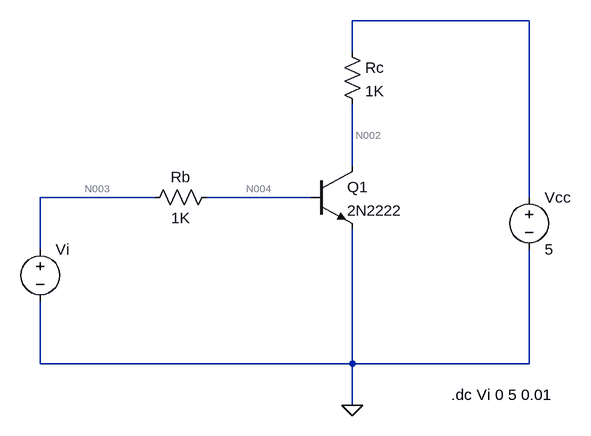
[diagram p0: schematic 12.asc]
12.asc, the LTspice schematic file:
Version 4.1
SHEET 1 880 680
WIRE 544 -96 272 -96
WIRE 272 -48 272 -96
WIRE 272 128 272 32
WIRE -32 176 -208 176
WIRE 208 176 48 176
WIRE 544 176 544 -96
WIRE -208 256 -208 176
WIRE -208 432 -208 336
WIRE 272 432 272 224
WIRE 272 432 -208 432
WIRE 544 432 544 256
WIRE 544 432 272 432
WIRE 272 496 272 432
FLAG 272 496 0
SYMBOL res 64 160 R90
WINDOW 0 0 56 VBottom 2
WINDOW 3 32 56 VTop 2
SYMATTR InstName Rb
SYMATTR Value 1K
SYMBOL voltage -208 240 R0
SYMATTR InstName Vi
SYMATTR Value ""
SYMBOL voltage 544 160 R0
SYMATTR InstName Vcc
SYMATTR Value 5
SYMBOL res 256 -64 R0
SYMATTR InstName Rc
SYMATTR Value 1K
SYMBOL npn 208 128 R0
SYMATTR InstName Q1
SYMATTR Value 2N2222
TEXT 424 480 Left 2 !.dc Vi 0 5 0.01

The netlist it stands for:
* 12.asc
Rb N004 N003 1K
Vi N003 0
Vcc N001 0 5
Rc N001 N002 1K
Q1 N002 N004 0 0 2N2222
.model NPN NPN
.model PNP PNP
.lib standard.bjt
.dc Vi 0 5 0.01
.backanno
.end

* Results of the author's LTspice run, read from the files saved beside the schematic
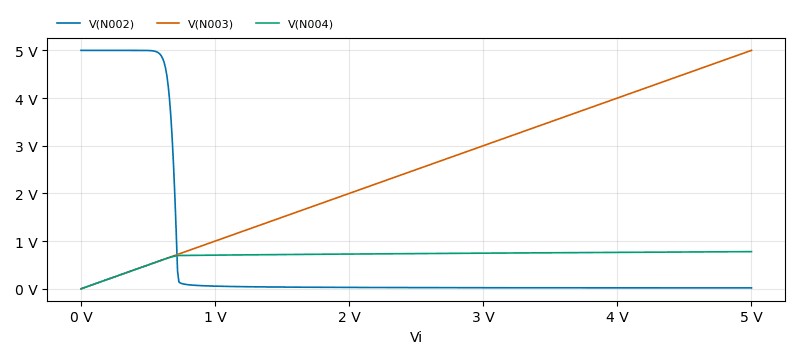
[diagram p1: DC transfer characteristic of 12.asc, plotted from the saved traces]
* DC transfer characteristic, 1 run:
*   V(N002): 5 V at Vi=0 V, 18.45 mV at Vi=5 V, min 18.45 mV, max 5 V
*   V(N003): 0 V at Vi=0 V, 5 V at Vi=5 V, min 0 V, max 5 V
*   V(N004): 5.003 nV at Vi=0 V, 779.3 mV at Vi=5 V, min 5.003 nV, max 779.3 mV